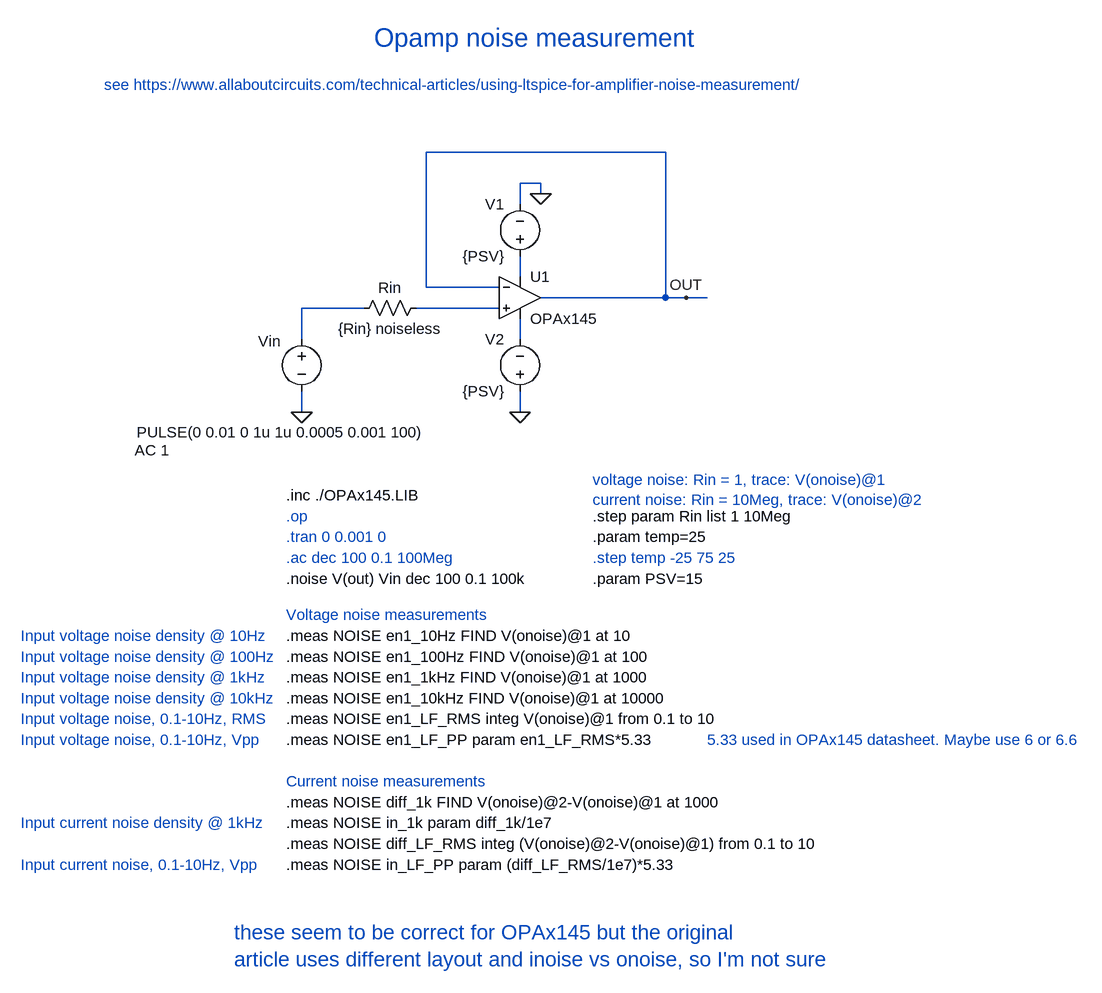
[diagram p0: schematic opamp noise.asc]
opamp noise.asc, the LTspice schematic file:
Version 4
SHEET 1 1268 1328
WIRE 624 48 256 48
WIRE 432 96 400 96
WIRE 432 112 432 96
WIRE 400 128 400 96
WIRE 400 240 400 208
WIRE 256 256 256 48
WIRE 368 256 256 256
WIRE 624 272 624 48
WIRE 624 272 432 272
WIRE 656 272 624 272
WIRE 688 272 656 272
WIRE 160 288 64 288
WIRE 368 288 240 288
WIRE 64 336 64 288
WIRE 400 336 400 304
WIRE 64 448 64 416
WIRE 400 448 400 416
FLAG 432 112 0
FLAG 400 448 0
FLAG 656 272 OUT
FLAG 64 448 0
SYMBOL Opamps/opamp2 400 208 R0
SYMATTR InstName U1
SYMATTR Value OPAx145
SYMBOL voltage 400 224 R180
WINDOW 0 24 96 Left 2
WINDOW 3 24 16 Left 2
SYMATTR InstName V1
SYMATTR Value {PSV}
SYMBOL voltage 400 432 R180
WINDOW 0 24 96 Left 2
WINDOW 3 24 16 Left 2
SYMATTR InstName V2
SYMATTR Value {PSV}
SYMBOL voltage 64 320 R0
WINDOW 0 -67 19 Left 2
WINDOW 3 -254 159 Left 2
WINDOW 123 -257 187 Left 2
SYMATTR InstName Vin
SYMATTR Value PULSE(0 0.01 0 1u 1u 0.0005 0.001 100)
SYMATTR Value2 AC 1
SYMBOL Res 256 272 R90
WINDOW 0 0 56 VBottom 2
WINDOW 3 32 56 VTop 2
SYMATTR InstName Rin
SYMATTR Value {Rin} noiseless
TEXT 40 576 Left 2 !.inc ./OPAx145.LIB
TEXT 40 704 Left 2 !.noise V(out) Vin dec 100 0.1 100k
TEXT 40 608 Left 2 ;.op
TEXT 40 640 Left 2 ;.tran 0 0.001 0
TEXT 512 608 Left 2 !.step param Rin list 1 10Meg
TEXT 512 552 Left 2 ;voltage noise: Rin = 1, trace: V(onoise)@1\ncurrent noise: Rin = 10Meg, trace: V(onoise)@2
TEXT 512 640 Left 2 !.param temp=25
TEXT 512 672 Left 2 ;.step temp -25 75 25
TEXT 512 704 Left 2 !.param PSV=15
TEXT 40 672 Left 2 ;.ac dec 100 0.1 100Meg
TEXT -240 -56 Left 2 ;see https://www.allaboutcircuits.com/technical-articles/using-ltspice-for-amplifier-noise-measurement/
TEXT 176 -128 Left 4 ;Opamp noise measurement
TEXT 40 760 Left 2 ;Voltage noise measurements
TEXT 40 792 Left 2 !.meas NOISE en1_10Hz FIND V(onoise)@1 at 10
TEXT 40 824 Left 2 !.meas NOISE en1_100Hz FIND V(onoise)@1 at 100
TEXT 40 856 Left 2 !.meas NOISE en1_1kHz FIND V(onoise)@1 at 1000
TEXT 40 888 Left 2 !.meas NOISE en1_10kHz FIND V(onoise)@1 at 10000
TEXT 40 920 Left 2 !.meas NOISE en1_LF_RMS integ V(onoise)@1 from 0.1 to 10
TEXT 40 952 Left 2 !.meas NOISE en1_LF_PP param en1_LF_RMS*5.33
TEXT 688 952 Left 2 ;5.33 used in OPAx145 datasheet. Maybe use 6 or 6.6
TEXT 40 1016 Left 2 ;Current noise measurements
TEXT -368 792 Left 2 ;Input voltage noise density @ 10Hz
TEXT -368 824 Left 2 ;Input voltage noise density @ 100Hz
TEXT -368 856 Left 2 ;Input voltage noise density @ 1kHz
TEXT -368 888 Left 2 ;Input voltage noise density @ 10kHz
TEXT -368 920 Left 2 ;Input voltage noise, 0.1-10Hz, RMS
TEXT -368 952 Left 2 ;Input voltage noise, 0.1-10Hz, Vpp
TEXT 40 1080 Left 2 !.meas NOISE in_1k param diff_1k/1e7
TEXT 40 1048 Left 2 !.meas NOISE diff_1k FIND V(onoise)@2-V(onoise)@1 at 1000
TEXT 40 1112 Left 2 !.meas NOISE diff_LF_RMS integ (V(onoise)@2-V(onoise)@1) from 0.1 to 10
TEXT 40 1144 Left 2 !.meas NOISE in_LF_PP param (diff_LF_RMS/1e7)*5.33
TEXT -368 1080 Left 2 ;Input current noise density @ 1kHz
TEXT -368 1144 Left 2 ;Input current noise, 0.1-10Hz, Vpp
TEXT -40 1248 Left 3 ;these seem to be correct for OPAx145 but the original\narticle uses different layout and inoise vs onoise, so I'm not sure

The netlist it stands for:
* opamp noise.asc
XU1 N003 OUT N001 N004 OUT OPAx145  ; pins In+ In- V+ V- OUT
V1 N001 0 {PSV}
V2 0 N004 {PSV}
Vin N002 0 PULSE(0 0.01 0 1u 1u 0.0005 0.001 100) AC 1
Rin N003 N002 {Rin} noiseless
.inc ./OPAx145.LIB
.noise V(out) Vin dec 100 0.1 100k
* .op
* .tran 0 0.001 0
.step param Rin list 1 10Meg
* voltage noise: Rin = 1, trace: V(onoise)@1
* current noise: Rin = 10Meg, trace: V(onoise)@2
.param temp=25
* .step temp -25 75 25
.param PSV=15
* .ac dec 100 0.1 100Meg
* see https://www.allaboutcircuits.com/technical-articles/using-ltspice-for-amplifier-noise-measurement/
* Opamp noise measurement
* Voltage noise measurements
.meas NOISE en1_10Hz FIND V(onoise)@1 at 10
.meas NOISE en1_100Hz FIND V(onoise)@1 at 100
.meas NOISE en1_1kHz FIND V(onoise)@1 at 1000
.meas NOISE en1_10kHz FIND V(onoise)@1 at 10000
.meas NOISE en1_LF_RMS integ V(onoise)@1 from 0.1 to 10
.meas NOISE en1_LF_PP param en1_LF_RMS*5.33
* 5.33 used in OPAx145 datasheet. Maybe use 6 or 6.6
* Current noise measurements
* Input voltage noise density @ 10Hz
* Input voltage noise density @ 100Hz
* Input voltage noise density @ 1kHz
* Input voltage noise density @ 10kHz
* Input voltage noise, 0.1-10Hz, RMS
* Input voltage noise, 0.1-10Hz, Vpp
.meas NOISE in_1k param diff_1k/1e7
.meas NOISE diff_1k FIND V(onoise)@2-V(onoise)@1 at 1000
.meas NOISE diff_LF_RMS integ (V(onoise)@2-V(onoise)@1) from 0.1 to 10
.meas NOISE in_LF_PP param (diff_LF_RMS/1e7)*5.33
* Input current noise density @ 1kHz
* Input current noise, 0.1-10Hz, Vpp
* these seem to be correct for OPAx145 but the original
* article uses different layout and inoise vs onoise, so I'm not sure
.backanno
.end